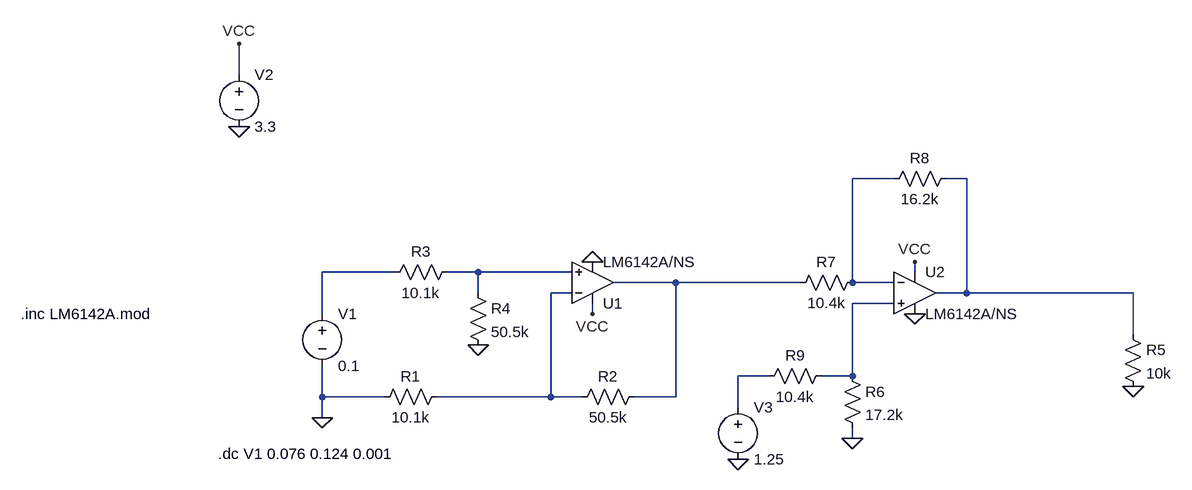
[diagram p0: schematic RTD.asc]
RTD.asc, the LTspice schematic file:
Version 4
SHEET 1 1332 680
WIRE -112 -304 -112 -352
WIRE 896 -144 832 -144
WIRE 1008 -144 976 -144
WIRE 128 0 16 0
WIRE 256 0 208 0
WIRE 400 0 256 0
WIRE 928 0 928 -16
WIRE 560 16 464 16
WIRE 752 16 560 16
WIRE 832 16 832 -144
WIRE 896 16 832 16
WIRE 256 32 256 0
WIRE 400 32 368 32
WIRE 1008 32 1008 -144
WIRE 1008 32 960 32
WIRE 1264 32 1008 32
WIRE 896 48 832 48
WIRE 16 64 16 0
WIRE 432 64 432 48
WIRE 1264 96 1264 32
WIRE 704 160 656 160
WIRE 832 160 832 48
WIRE 832 160 784 160
WIRE 16 192 16 144
WIRE 112 192 16 192
WIRE 368 192 368 32
WIRE 368 192 192 192
WIRE 416 192 368 192
WIRE 560 192 560 16
WIRE 560 192 496 192
WIRE 656 208 656 160
WIRE 16 224 16 192
WIRE 832 256 832 240
FLAG -112 -224 0
FLAG 16 224 0
FLAG 256 112 0
FLAG 1264 176 0
FLAG 432 64 VCC
FLAG -112 -352 VCC
FLAG 432 -16 0
FLAG 928 -16 VCC
FLAG 928 64 0
FLAG 656 288 0
FLAG 832 256 0
SYMBOL voltage 16 48 R0
WINDOW 123 0 0 Left 2
WINDOW 39 0 0 Left 2
SYMATTR InstName V1
SYMATTR Value 0.1
SYMBOL voltage -112 -320 R0
WINDOW 123 0 0 Left 2
WINDOW 39 0 0 Left 2
SYMATTR InstName V2
SYMATTR Value 3.3
SYMBOL res 240 16 R0
SYMATTR InstName R4
SYMATTR Value 50.5k
SYMBOL res 224 -16 R90
WINDOW 0 0 56 VBottom 2
WINDOW 3 32 56 VTop 2
SYMATTR InstName R3
SYMATTR Value 10.1k
SYMBOL res 208 176 R90
WINDOW 0 0 56 VBottom 2
WINDOW 3 32 56 VTop 2
SYMATTR InstName R1
SYMATTR Value 10.1k
SYMBOL res 512 176 R90
WINDOW 0 0 56 VBottom 2
WINDOW 3 32 56 VTop 2
SYMATTR InstName R2
SYMATTR Value 50.5k
SYMBOL res 1248 80 R0
SYMATTR InstName R5
SYMATTR Value 10k
SYMBOL Opamps\\opamp2 432 80 M180
SYMATTR InstName U1
SYMATTR Value LM6142A/NS
SYMBOL Opamps\\opamp2 928 -32 R0
SYMATTR InstName U2
SYMATTR Value LM6142A/NS
SYMBOL res 816 144 R0
SYMATTR InstName R6
SYMATTR Value 17.2k
SYMBOL res 848 0 R90
WINDOW 0 0 56 VBottom 2
WINDOW 3 32 56 VTop 2
SYMATTR InstName R7
SYMATTR Value 10.4k
SYMBOL res 992 -160 R90
WINDOW 0 0 56 VBottom 2
WINDOW 3 32 56 VTop 2
SYMATTR InstName R8
SYMATTR Value 16.2k
SYMBOL res 800 144 R90
WINDOW 0 0 56 VBottom 2
WINDOW 3 32 56 VTop 2
SYMATTR InstName R9
SYMATTR Value 10.4k
SYMBOL voltage 656 192 R0
WINDOW 123 0 0 Left 2
WINDOW 39 0 0 Left 2
SYMATTR InstName V3
SYMATTR Value 1.25
TEXT -144 280 Left 2 !.dc V1 0.076 0.124 0.001
TEXT -448 64 Left 2 !.inc LM6142A.mod

The netlist it stands for:
* RTD.asc
V1 N003 0 0.1
V2 VCC 0 3.3
R4 N004 0 50.5k
R3 N004 N003 10.1k
R1 N006 0 10.1k
R2 N005 N006 50.5k
R5 N002 0 10k
XU1 N004 N006 VCC 0 N005 LM6142A/NS  ; pins In+ In- V+ V- OUT
XU2 N007 N001 VCC 0 N002 LM6142A/NS  ; pins In+ In- V+ V- OUT
R6 N007 0 17.2k
R7 N001 N005 10.4k
R8 N002 N001 16.2k
R9 N007 N008 10.4k
V3 N008 0 1.25
.dc V1 0.076 0.124 0.001
.inc LM6142A.mod
.backanno
.end